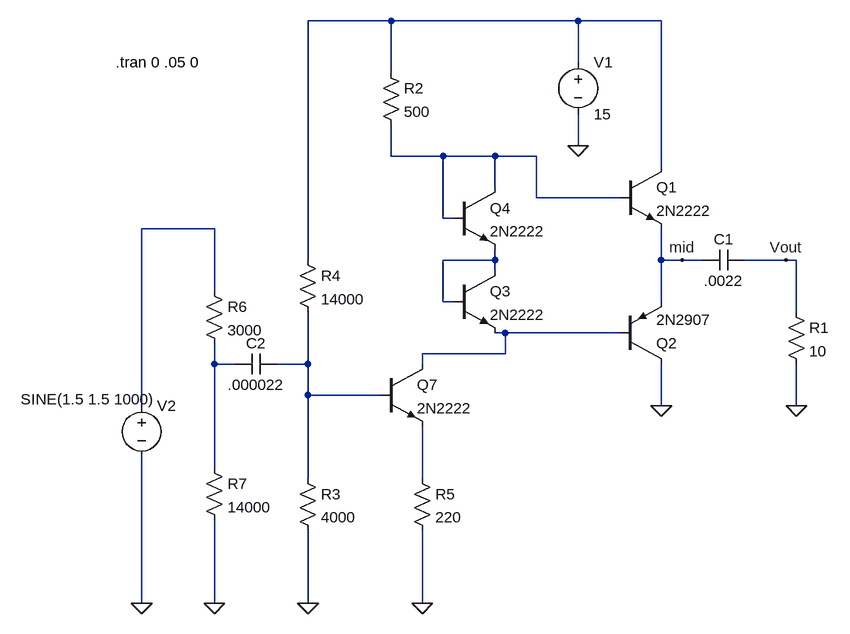
[diagram p0: schematic VCA.asc]
VCA.asc, the LTspice schematic file:
Version 4
SHEET 1 880 740
WIRE -240 -176 -368 -176
WIRE 48 -176 -240 -176
WIRE 176 -176 48 -176
WIRE 48 -112 48 -176
WIRE -240 -96 -240 -176
WIRE 48 16 48 -32
WIRE -240 32 -240 -16
WIRE -160 32 -240 32
WIRE -80 32 -160 32
WIRE -16 32 -80 32
WIRE 176 48 176 -176
WIRE -80 80 -80 32
WIRE -16 96 -16 32
WIRE 112 96 -16 96
WIRE -160 128 -160 32
WIRE -144 128 -160 128
WIRE -512 144 -624 144
WIRE -368 192 -368 -176
WIRE -80 192 -80 176
WIRE -80 192 -160 192
WIRE 176 192 176 144
WIRE 208 192 176 192
WIRE 240 192 208 192
WIRE 368 192 304 192
WIRE 384 192 368 192
WIRE -80 208 -80 192
WIRE -512 240 -512 144
WIRE -160 256 -160 192
WIRE -144 256 -160 256
WIRE 176 256 176 192
WIRE 384 272 384 192
WIRE -64 304 -80 304
WIRE 112 304 -64 304
WIRE -64 336 -64 304
WIRE -64 336 -192 336
WIRE -512 352 -512 320
WIRE -480 352 -512 352
WIRE -368 352 -368 272
WIRE -368 352 -416 352
WIRE -192 352 -192 336
WIRE -368 400 -368 352
WIRE -256 400 -368 400
WIRE -624 416 -624 144
WIRE 176 416 176 352
WIRE 384 416 384 352
WIRE -512 512 -512 352
WIRE -368 528 -368 400
WIRE -192 528 -192 448
WIRE -624 720 -624 496
WIRE -512 720 -512 592
WIRE -368 720 -368 608
WIRE -192 720 -192 608
FLAG 176 416 0
FLAG 384 416 0
FLAG 368 192 Vout
FLAG 208 192 mid
FLAG -192 720 0
FLAG 48 16 0
FLAG -624 720 0
FLAG -368 720 0
FLAG -512 720 0
SYMBOL npn 112 48 R0
SYMATTR InstName Q1
SYMATTR Value 2N2222
SYMBOL res 368 256 R0
SYMATTR InstName R1
SYMATTR Value 10
SYMBOL voltage 48 -128 R0
WINDOW 123 0 0 Left 2
WINDOW 39 0 0 Left 2
SYMATTR InstName V1
SYMATTR Value 15
SYMBOL pnp 112 352 M180
SYMATTR InstName Q2
SYMATTR Value 2N2907
SYMBOL cap 304 176 R90
WINDOW 0 0 32 VBottom 2
WINDOW 3 32 32 VTop 2
SYMATTR InstName C1
SYMATTR Value .0022
SYMBOL npn -144 208 R0
SYMATTR InstName Q3
SYMATTR Value 2N2222
SYMBOL res -256 -112 R0
SYMATTR InstName R2
SYMATTR Value 500
SYMBOL npn -144 80 R0
SYMATTR InstName Q4
SYMATTR Value 2N2222
SYMBOL voltage -624 400 R0
WINDOW 3 -186 6 Left 2
WINDOW 123 0 0 Left 2
WINDOW 39 0 0 Left 2
SYMATTR Value SINE(1.5 1.5 1000)
SYMATTR InstName V2
SYMBOL cap -416 336 R90
WINDOW 0 0 32 VBottom 2
WINDOW 3 32 32 VTop 2
SYMATTR InstName C2
SYMATTR Value .000022
SYMBOL res -384 512 R0
SYMATTR InstName R3
SYMATTR Value 4000
SYMBOL res -384 176 R0
SYMATTR InstName R4
SYMATTR Value 14000
SYMBOL npn -256 352 R0
SYMATTR InstName Q7
SYMATTR Value 2N2222
SYMBOL res -208 512 R0
SYMATTR InstName R5
SYMATTR Value 220
SYMBOL res -528 224 R0
SYMATTR InstName R6
SYMATTR Value 3000
SYMBOL res -528 496 R0
SYMATTR InstName R7
SYMATTR Value 14000
TEXT -664 -112 Left 2 !.tran 0 .05 0

The netlist it stands for:
* VCA.asc
Q1 N001 N002 mid 0 2N2222
R1 Vout 0 10
V1 N001 0 15
Q2 0 N005 mid 0 2N2907
C1 Vout mid .0022
Q3 N004 N004 N005 0 2N2222
R2 N001 N002 500
Q4 N002 N002 N004 0 2N2222
V2 N003 0 SINE(1.5 1.5 1000)
C2 N007 N006 .000022
R3 N007 0 4000
R4 N001 N007 14000
Q7 N005 N007 N008 0 2N2222
R5 N008 0 220
R6 N003 N006 3000
R7 N006 0 14000
.model NPN NPN
.model PNP PNP
.lib standard.bjt
.tran 0 .05 0
.backanno
.end